# Altium schematic sheet drvinput1.SchDoc
size A4
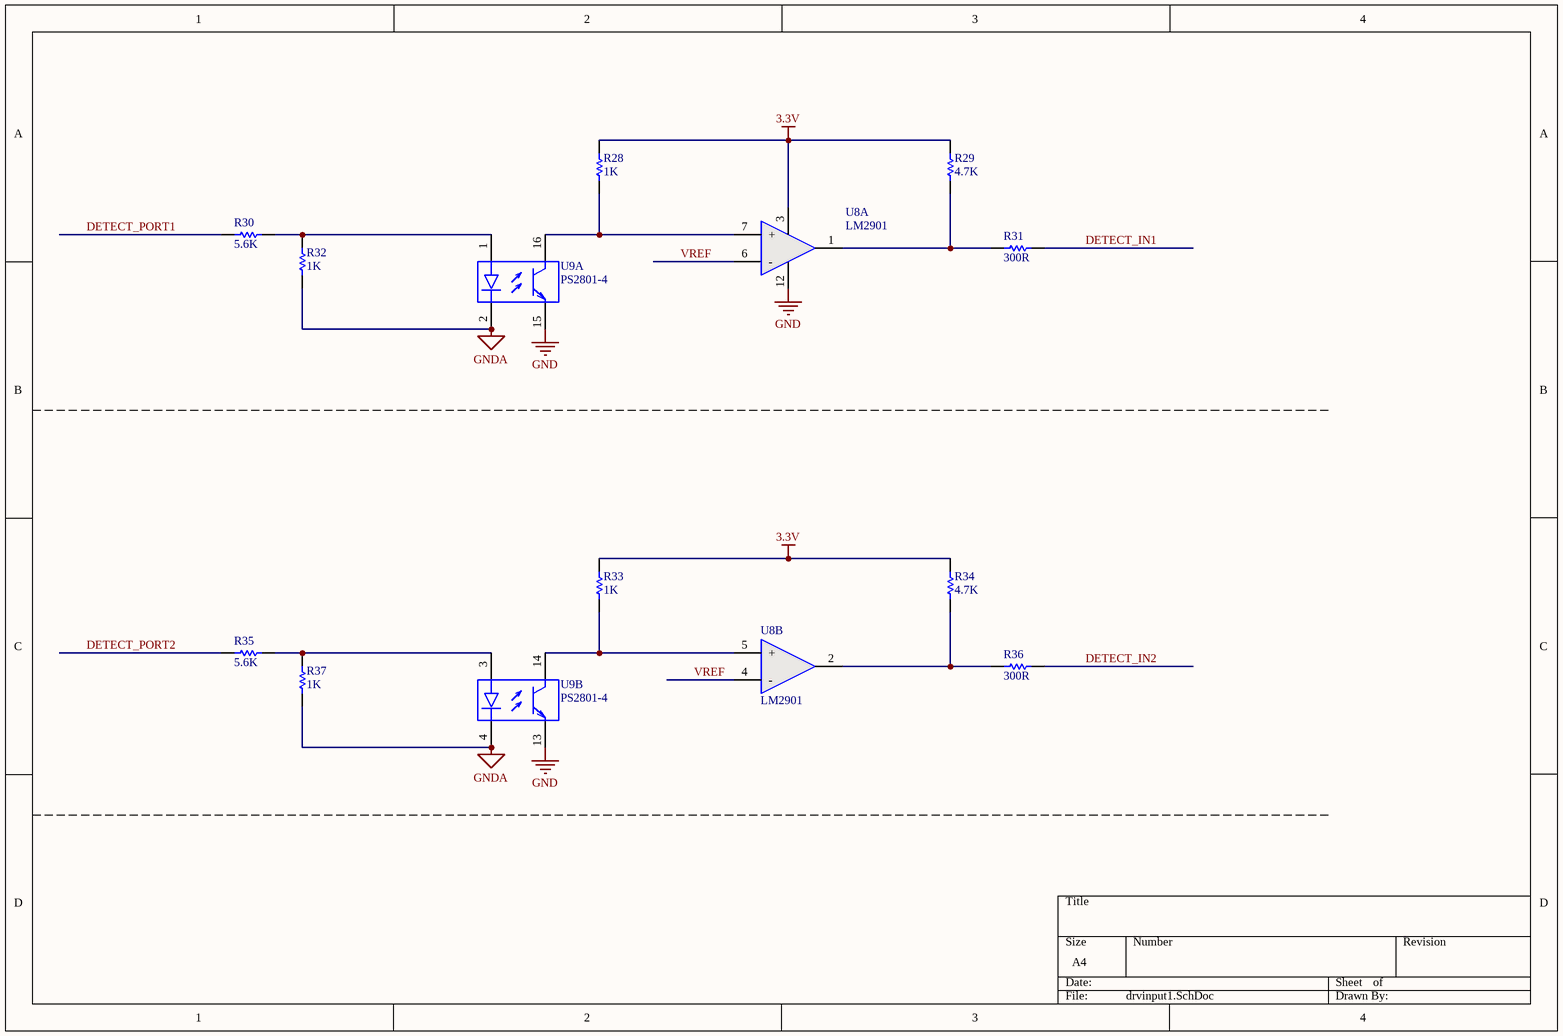
[diagram p0: drvinput1.SchDoc]

## Parts
R28  1K  [RESC2012M]
R29  4.7K  [RESC2012M]
R30  5.6K  [RESC2012M]
R31  300R  [RESC2012M]
R32  1K  [RESC2012M]
R33  1K  [RESC2012M]
R34  4.7K  [RESC2012M]
R35  5.6K  [RESC2012M]
R36  300R  [RESC2012M]
R37  1K  [RESC2012M]
U8  LM2901  [SOIC-14AM]  (parts A,B of 4)
U9  PS2801-4  [SOIC16_N]  (parts A,B of 4)

## Nets
3.3V: R28.1 R29.2 R33.1 R34.2 U8.3(V+)
GND: U8.12(V-) U9.13(E) U9.15(E)
GNDA: R32.1 R37.1 U9.2(-) U9.4(-)
DETECT_IN1: R31.1
DETECT_IN2: R36.2
DETECT_PORT1: R30.2
DETECT_PORT2: R35.2
VREF: U8.4(-) U8.6(-)
NetR28_2: R28.2 U8.7(+) U9.16(C)
NetR29_1: R29.1 R31.2 U8.1(OUT)
NetR30_1: R30.1 R32.2 U9.1(+)
NetR33_2: R33.2 U8.5(+) U9.14(C)
NetR34_1: R34.1 R36.1 U8.2(OUT)
NetR35_1: R35.1 R37.2 U9.3(+)

## Library data of the parts
R28-R35 R37 = Res1: Resistor; Value: 10K; Published: 8-Jun-2000; LatestRevisionDate: 17-Jul-2002; LatestRevisionNote: Re-released for DXP Platform.; PackageReference: AXIAL-0.3; Publisher: Altium Limited
R36 = Res1: Resistor; Value: 470; Published: 8-Jun-2000; LatestRevisionDate: 17-Jul-2002; LatestRevisionNote: Re-released for DXP Platform.; PackageReference: AXIAL-0.3; Publisher: Altium Limited
U8 = LM2901: 4通道差分比较器芯片
U9 = PS2801-4: The PS2801-1 and PS2801-4 are optically coupled isolators containing a GaAs light emitting diode and an NPN  silicon phototransistor in a plastic SOP for high density applications.; Published: 28-Feb-2003; LatestRevisionDate: 13-Apr-2006; LatestRevisionNote: IPC-7351 Footprint Added.; DatasheetVersion: Jan-2002, Rev. 7; PackageVersion: rev7, Jan-2002; PackageReference: 751-07; Publisher: Altium Limited; PackageDescription: 8-Pin Plastic Small Outline Integrated Circuit 1.27 mm Pitch; Code_JEDEC: MS-012-AA; Code_IPC: SOIC127P600-8; ComponentLink1Description: Manufacturer Link; ComponentLink1URL: http://www.onsemi.com/; ComponentLink2Description: Datasheet; ComponentLink2URL: http://www.onsemi.com/pub/Collateral/LM358-D.PDF